# EAGLE design ttl_net (EAGLE 6.6.0)
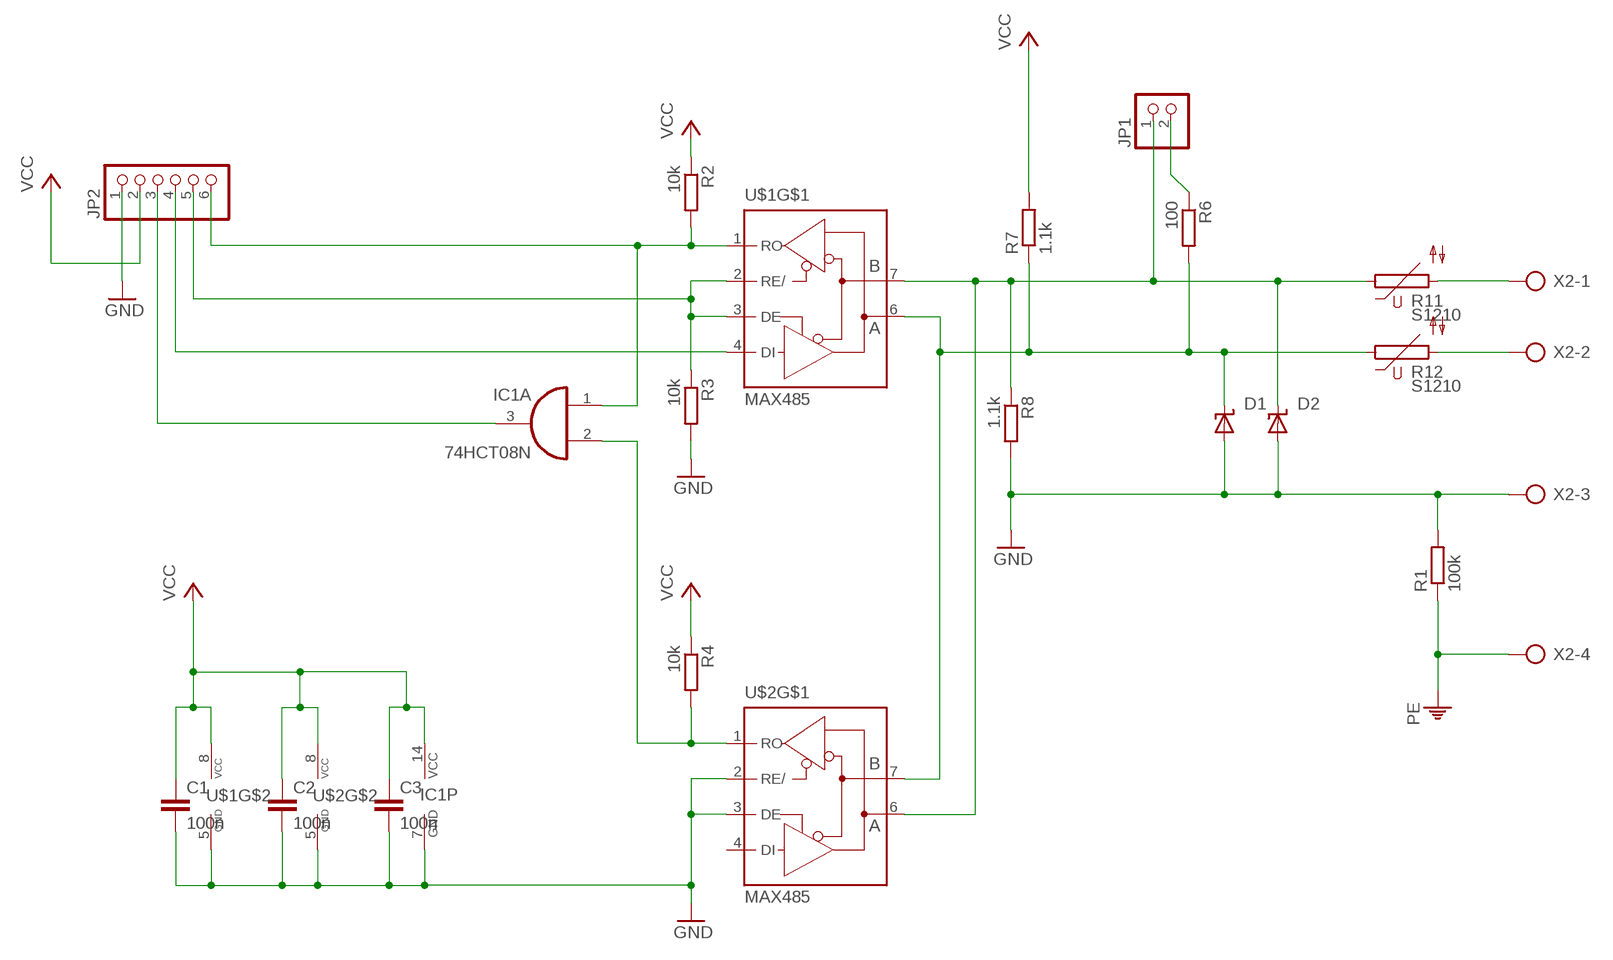
[diagram p0: schematic, sheet 1]

## Parts
C1  100n  C-EU050-035X075  [C050-035X075]
C2  100n  C-EU050-035X075  [C050-035X075]
C3  100n  C-EU050-035X075  [C050-035X075]
D1  SUPPRESSOR-SMBJ  [SMBJ]
D2  SUPPRESSOR-SMBJ  [SMBJ]
IC1  74HCT08N  [DIL14]
JP1  PINHD-1X2  [1X02]
JP2  PINHD-1X6  [1X06]
R1  100k  R-EU_0204/7  [0204/7]
R2  10k  R-EU_0204/7  [0204/7]
R3  10k  R-EU_0204/7  [0204/7]
R4  10k  R-EU_0204/7  [0204/7]
R6  100  R-EU_0204/7  [0204/7]
R7  1.1k  R-EU_0204/7  [0204/7]
R8  1.1k  R-EU_0204/7  [0204/7]
R11  S1210  [S1210]
R12  S1210  [S1210]
U$1  MAX485  [DIL08]
U$2  MAX485  [DIL08]
X2  AK500/4  [AK500/4]

## Nets
GND: C1.2 C2.2 C3.2 D1.A D2.A IC1.7(P:GND) JP2.1 R1.2 R3.2 R8.2 U$1.5(GND) U$2.2(RE/) U$2.3(DE) U$2.5(GND) X2.3
N$1: JP2.5 R3.1 U$1.2(RE/) U$1.3(DE)
N$2: D1.C R6.2 R7.1 R12.1 U$1.6(A) U$2.7(B)
N$3: IC1.2(A:I1) R4.2 U$2.1(RO)
N$4: JP2.4 U$1.4(DI)
N$5: IC1.3(A:O) JP2.3
N$6: IC1.1(A:I0) JP2.6 R2.2 U$1.1(RO)
N$8: JP1.2 R6.1
N$9: R11.2 X2.1
N$10: D2.C JP1.1 R8.1 R11.1 U$1.7(B) U$2.6(A)
N$11: R12.2 X2.2
PE: R1.1 X2.4
VCC: C1.1 C2.1 C3.1 IC1.14(P:VCC) JP2.2 R2.1 R4.1 R7.2 U$1.8(VCC) U$2.8(VCC)
Unconnected: IC1.4(B:I0) IC1.5(B:I1) IC1.6(B:O) IC1.8(C:O) IC1.9(C:I0) IC1.10(C:I1) IC1.11(D:O) IC1.12(D:I0) IC1.13(D:I1) U$2.4(DI)

## Library data of the parts
C1-C3 = rcl:C-EU: CAPACITOR, European symbol
D1 D2 = diode:SUPPRESSOR-: Suppressor diode
IC1 = 74xx-eu:74*08: Quad 2-input AND gate
JP1 = pinhead:PINHD-1X2: PIN HEADER
JP2 = pinhead:PINHD-1X6: PIN HEADER
R1-R4 R6-R8 = resistor:R-EU_: RESISTOR, European symbol
R11 R12 = varistor:S1210: VARISTOR
U$1 U$2 = maxim:MAX485
X2 = con-ptr500:AK500/4: CONNECTOR; OC_FARNELL: unknown; OC_NEWARK: unknown

## Board
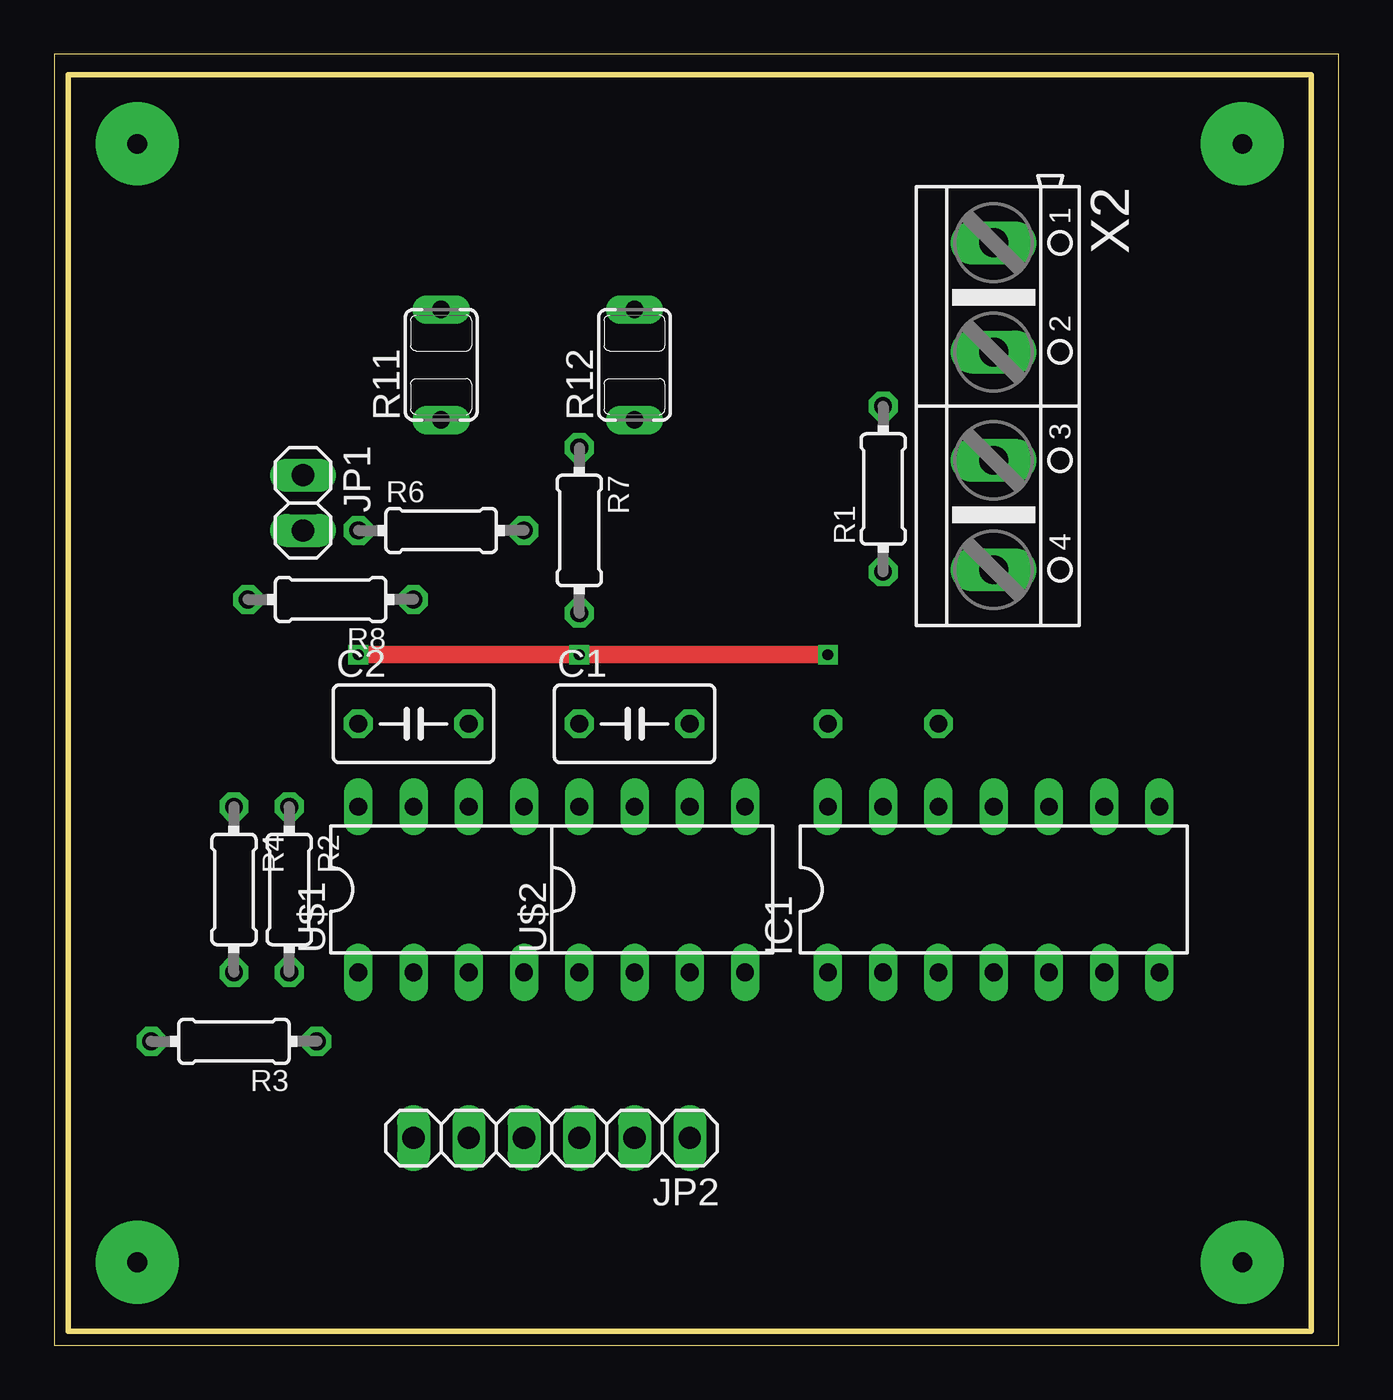
[diagram p1: board, top side]
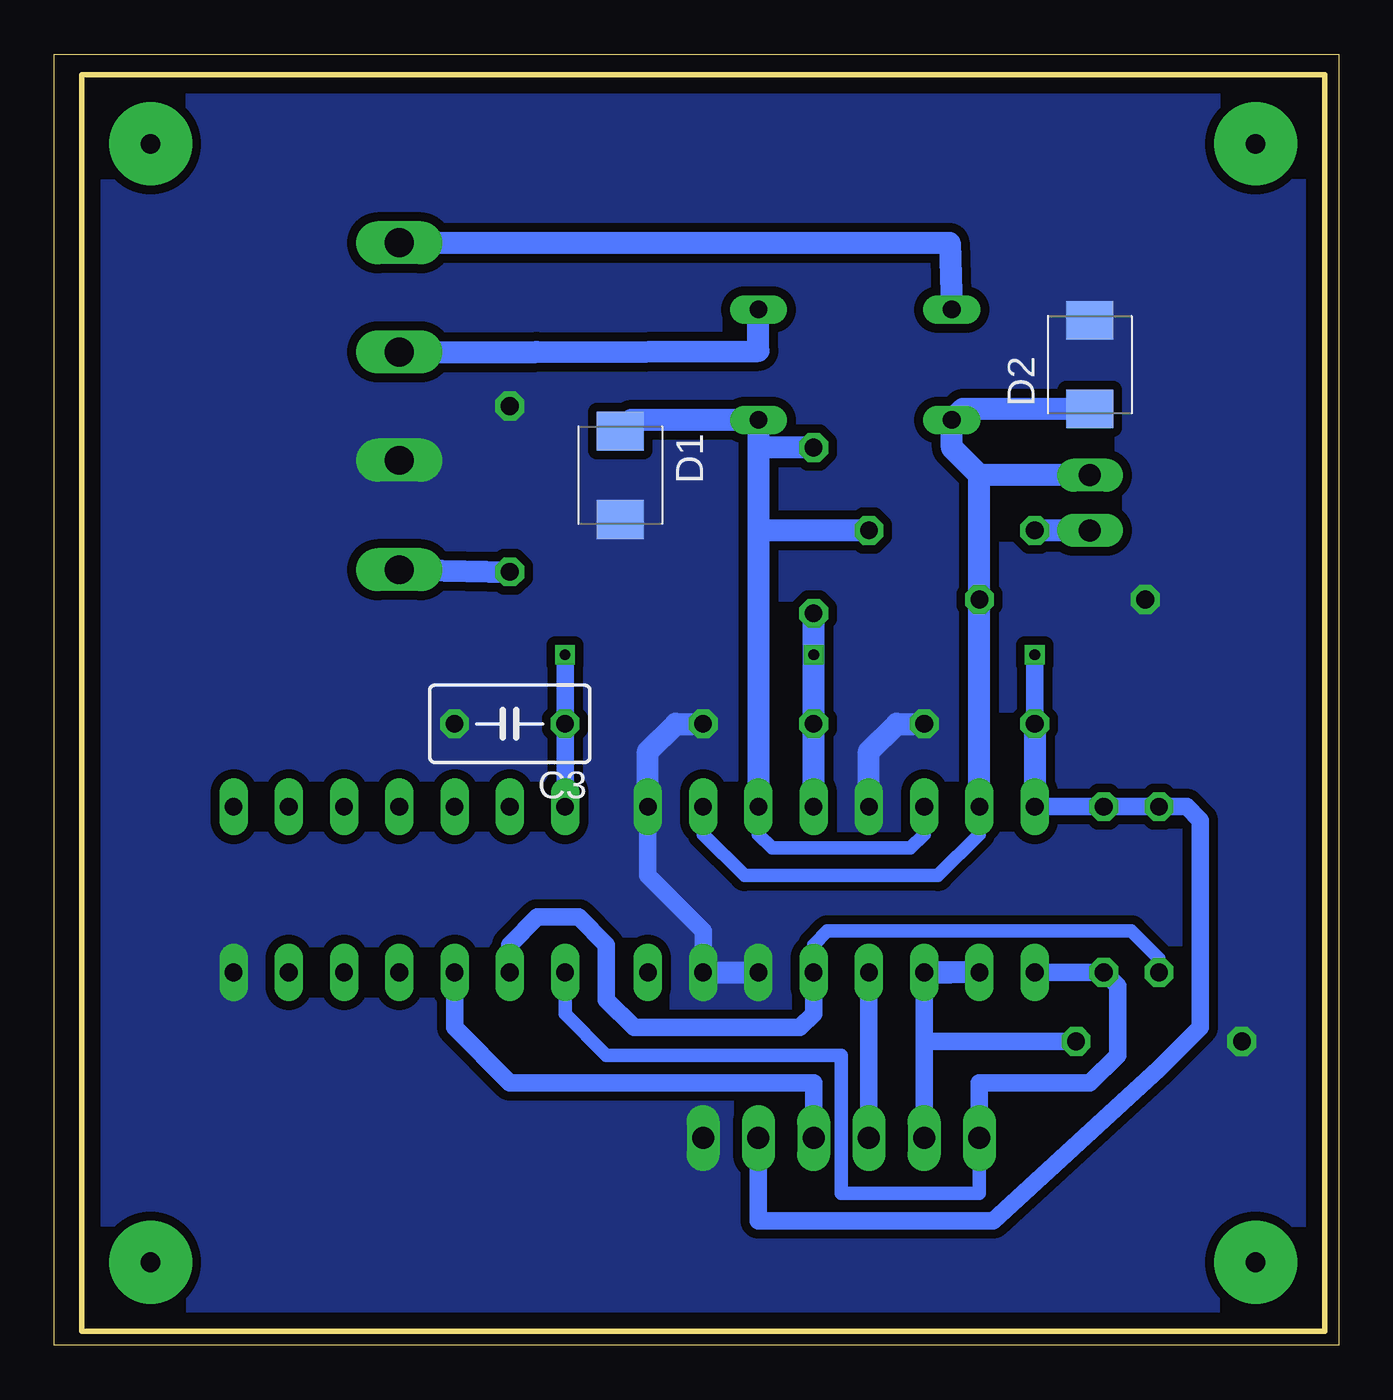
[diagram p2: board, bottom side, seen from below]

Size 59.03 x 59.36 mm. Coordinates in mm from the lower left corner, seen from the top.
Outline: 0,0 59.03,0 59.03,59.36 0,59.36 0,0
Copper layers (1*16): Top 0.035mm / dielectric 1.5mm / Bottom 0.035mm
Design rules "default": minimum track width 10mil, minimum drill 24mil, track to track 8mil, track to pad 8mil, pad to pad 8mil, via to via 8mil, smd to smd 8mil, copper to edge 40mil, drill to drill 8mil, minimum pad ring 10mil, minimum via ring 8mil, stop-mask expansion 4mil, vias tented up to drill 0mil, thermal gap 10mil
Milling: 4 lines

### Footprints (pad centres in the part's own frame; a part is rotated, then mirrored left to right if it is on the bottom)
C050-035X075 = drill 0.813 octagon: 1 -2.54,0; 2 2.54,0
SMBJ = smd 1.78 x 2.16: A 2.04,0; C -2.03,0
DIL14 = drill 0.813 long: 1 -7.62,-3.81; 2 -5.08,-3.81; 3 -2.54,-3.81; 4 0,-3.81; 5 2.54,-3.81; 6 5.08,-3.81; 7 7.62,-3.81; 8 7.62,3.81; 9 5.08,3.81; 10 2.54,3.81; 11 0,3.81; 12 -2.54,3.81; 13 -5.08,3.81; 14 -7.62,3.81
1X02 = drill 1.016 long: 1 -1.27,0; 2 1.27,0
1X06 = drill 1.016 long: 1 -6.35,0; 2 -3.81,0; 3 -1.27,0; 4 1.27,0; 5 3.81,0; 6 6.35,0
0204/7 = drill 0.813 octagon: 1 -3.81,0; 2 3.81,0
S1210 = drill 0.813 long: 1 -2.54,0; 2 2.54,0
DIL08 = drill 0.813 long: 1 -3.81,-3.81; 2 -1.27,-3.81; 3 1.27,-3.81; 4 3.81,-3.81; 5 3.81,3.81; 6 1.27,3.81; 7 -1.27,3.81; 8 -3.81,3.81
AK500/4 = drill 1.321 long: 1 -7.518,0; 2 -2.489,0; 3 2.489,0; 4 7.518,0

### Placement (x,y rotation side)
C1  26.67,28.57 0 top
C2  16.51,28.57 0 top
C3  38.1,28.57 180 bottom
D1  33.02,40.01 270 bottom
D2  11.43,45.09 90 bottom
IC1  43.18,20.95 0 top
JP1  11.43,38.73 270 top
JP2  22.86,9.53 180 top
R1  38.1,39.37 90 top
R2  10.8,20.95 270 top
R3  8.26,13.97 180 top
R4  8.26,20.95 270 top
R6  17.78,37.47 0 top
R7  24.13,37.47 270 top
R8  12.7,34.29 180 top
R11  17.78,45.09 90 top
R12  26.67,45.09 90 top
U$1  17.78,20.95 0 top
U$2  27.94,20.95 0 top
X2  43.18,43.18 270 top

### Tracks (layer width: path | path; a pad name or v marks a point on that pad's centre or on a via)
GND
  Bottom 0.813: U$2.3 29.21,19.05 31.75,21.59 U$2.5
  Bottom 1.016: U$1.5 21.59,27.3 20.32,28.57 C2.2 | U$2.5 31.75,27.3 30.48,28.57 C1.2 | U$2.3 U$2.2
  pour Bottom (isolate 0.406, no thermals): 1.91,1.91 1.91,57.15 56.52,57.15 56.52,1.91
N$1
  Bottom 0.813: JP2.5 19.05,13.97 | 19.05,13.97 U$1.3 | R3.1 19.05,13.97
  Bottom 1.016: U$1.2 U$1.3 17.78,17.14
N$2
  Bottom 0.61: U$1.6 19.05,23.5 19.69,22.86 26.03,22.86 26.67,23.5 U$2.7
  Bottom 1.016: D1.C 32.51,42.55 R12.1 26.67,41.27 | 26.67,41.27 26.67,37.47 | 26.67,37.47 U$2.7 | R7.1 26.67,41.27 | R6.2 26.67,37.47
N$3
  Bottom 0.61: R4.2 8.26,17.78 9.52,19.05 23.49,19.05 24.13,18.41 U$2.1
  Bottom 0.813: IC1.2 38.1,18.41 36.83,19.68 34.92,19.68 33.66,18.41 33.66,15.88 32.38,14.61 24.77,14.61 24.13,15.24 U$2.1
N$4
  Bottom 0.813: JP2.4 U$1.4
N$5
  Bottom 0.813: JP2.3 24.13,12.06 38.1,12.06 40.64,14.61 IC1.3
N$6
  Bottom 0.61: IC1.1 35.56,15.24 33.66,13.34 22.86,13.34 22.86,6.99 16.51,6.99 JP2.6
  Bottom 0.813: U$1.1 R2.2 10.16,16.51 10.16,13.34 11.43,12.06 16.51,12.06 JP2.6
N$7  (via drill 0.9 pad 3.81)
  other vias: 3.81,55.24
N$8
  Bottom 1.016: JP1.2 R6.1
N$9
  Bottom 1.016: X2.1 17.88,50.7 R11.2
N$10
  Bottom 0.61: U$1.7 16.51,23.5 18.41,21.59 27.3,21.59 29.21,23.5 U$2.6
  Bottom 1.016: 16.51,40.01 R8.1 U$1.7 | 16.51,40.01 17.78,41.27 R11.1 17.27,43.05 D2.C | JP1.1 16.51,40.01
N$11
  Bottom 1.016: X2.2 36.88,45.67 26.67,45.72 R12.2
N$12  (via drill 0.9 pad 3.81)
  other vias: 54.61,55.24
N$13  (via drill 0.9 pad 3.81)
  other vias: 54.61,3.81
N$14  (via drill 0.9 pad 3.81)
  other vias: 3.81,3.81
PE
  Bottom 1.016: X2.4 R1.1
VCC  (via drill 0.5)
  Top 0.813: v13.97,31.75 v24.13,31.75 v35.56,31.75
  Bottom 0.813: U$1.8 R2.1 R4.1 6.98,24.77 6.35,24.13 6.35,14.61 8.26,12.7 15.88,5.71 26.67,5.71 JP2.2 | C2.1 v13.97,31.75 | v35.56,31.75 C3.1 IC1.14
  Bottom 1.016: C2.1 U$1.8 | U$2.8 C1.1 v24.13,31.75 R7.2